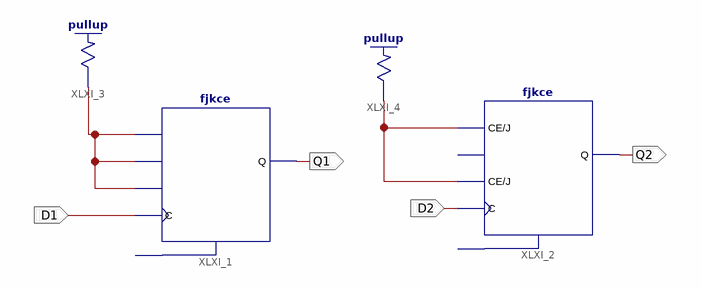
[diagram p0: schematic sheet 1]
// Xilinx ISE schematic test.sch (spartan3e) as structural Verilog: 4 symbols, 4 ports
module test (
  input  D1,
  input  D2,
  output Q1,
  output Q2
);

  wire XLXN_3, XLXN_8;

  fjkce XLXI_1 (.C(D1), .CE(XLXN_3), .J(XLXN_3), .K(XLXN_3), .Q(Q1));  // open: CLR
  fjkce XLXI_2 (.C(D2), .CE(XLXN_8), .J(XLXN_8), .Q(Q2));  // open: CLR, K
  \pullup  XLXI_3 (.O(XLXN_3));
  \pullup  XLXI_4 (.O(XLXN_8));
endmodule
